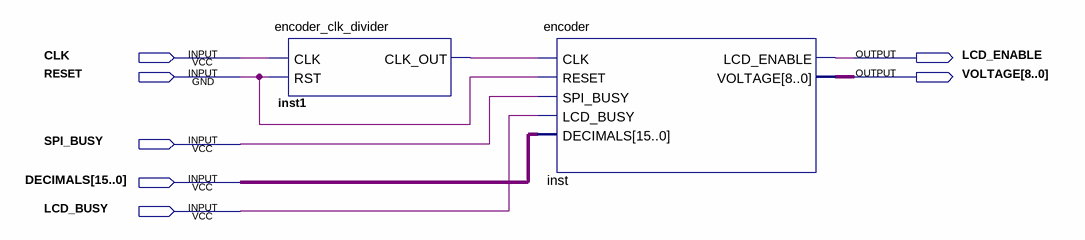
[diagram p0: schematic sheet]
// Quartus schematic encoder_full.bdf as structural Verilog: 2 symbols, 7 pins
module encoder_full (
  input  CLK,
  input  RESET,
  input  SPI_BUSY,
  input  [15:0] DECIMALS,
  input  LCD_BUSY,
  output LCD_ENABLE,
  output [8:0] VOLTAGE
);

  wire inst1_clk_out;

  encoder_clk_divider inst1 (.CLK(CLK), .RST(RESET), .CLK_OUT(inst1_clk_out));
  encoder inst (
    .CLK(inst1_clk_out), .RESET(RESET), .SPI_BUSY(SPI_BUSY), .LCD_BUSY(LCD_BUSY), .DECIMALS(DECIMALS),
    .LCD_ENABLE(LCD_ENABLE), .VOLTAGE(VOLTAGE));
endmodule
